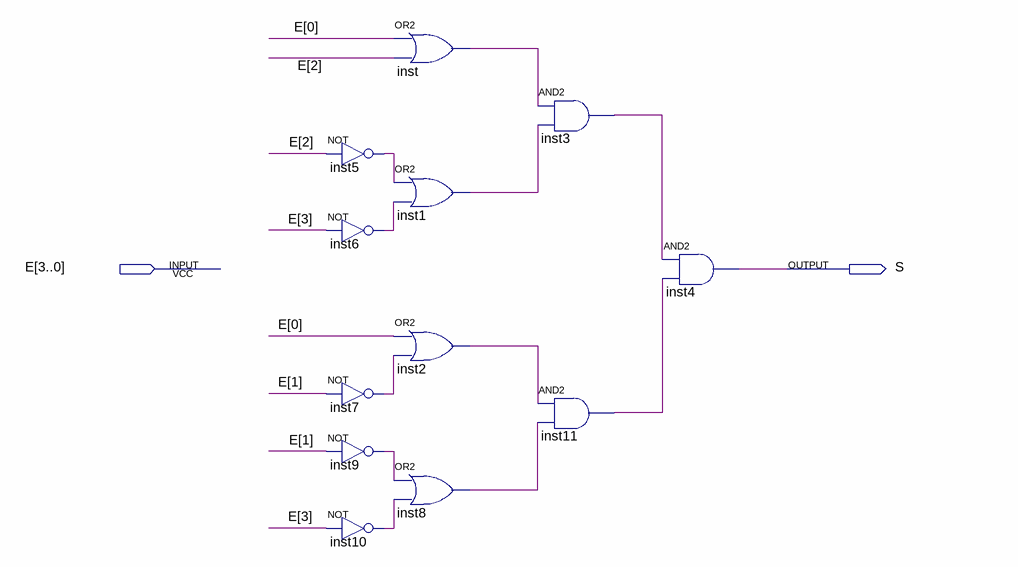
[diagram p0: schematic sheet]
// Quartus schematic seg_E.bdf as structural Verilog: 12 symbols, 2 pins
module seg_E (
  input  [3:0] E,
  output S
);

  wire inst1_out, inst2_out, inst3_out, inst5_out, inst6_out, inst7_out, inst8_out, inst9_out, inst10_out,
       inst11_out, inst_out;

  or inst (inst_out, E[0], E[2]);
  not inst5 (inst5_out, E[2]);
  or inst1 (inst1_out, inst5_out, inst6_out);
  not inst6 (inst6_out, E[3]);
  or inst2 (inst2_out, E[0], inst7_out);
  not inst7 (inst7_out, E[1]);
  not inst9 (inst9_out, E[1]);
  or inst8 (inst8_out, inst9_out, inst10_out);
  not inst10 (inst10_out, E[3]);
  and inst3 (inst3_out, inst_out, inst1_out);
  and inst11 (inst11_out, inst2_out, inst8_out);
  and inst4 (S, inst3_out, inst11_out);
endmodule
